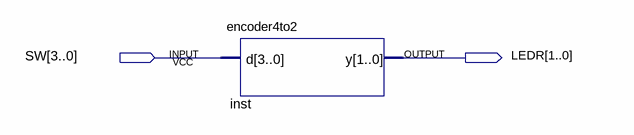
[diagram p0: schematic sheet]
// Quartus schematic block_encoder4to2.bdf as structural Verilog: 1 symbols, 2 pins
module block_encoder4to2 (
  input  [3:0] SW,
  output [1:0] LEDR
);

  encoder4to2 inst (.d(SW), .y(LEDR));
endmodule
